# Altium schematic sheet CANduino.SchDoc
size A3; SheetNumber: 1; SheetTotal: 1
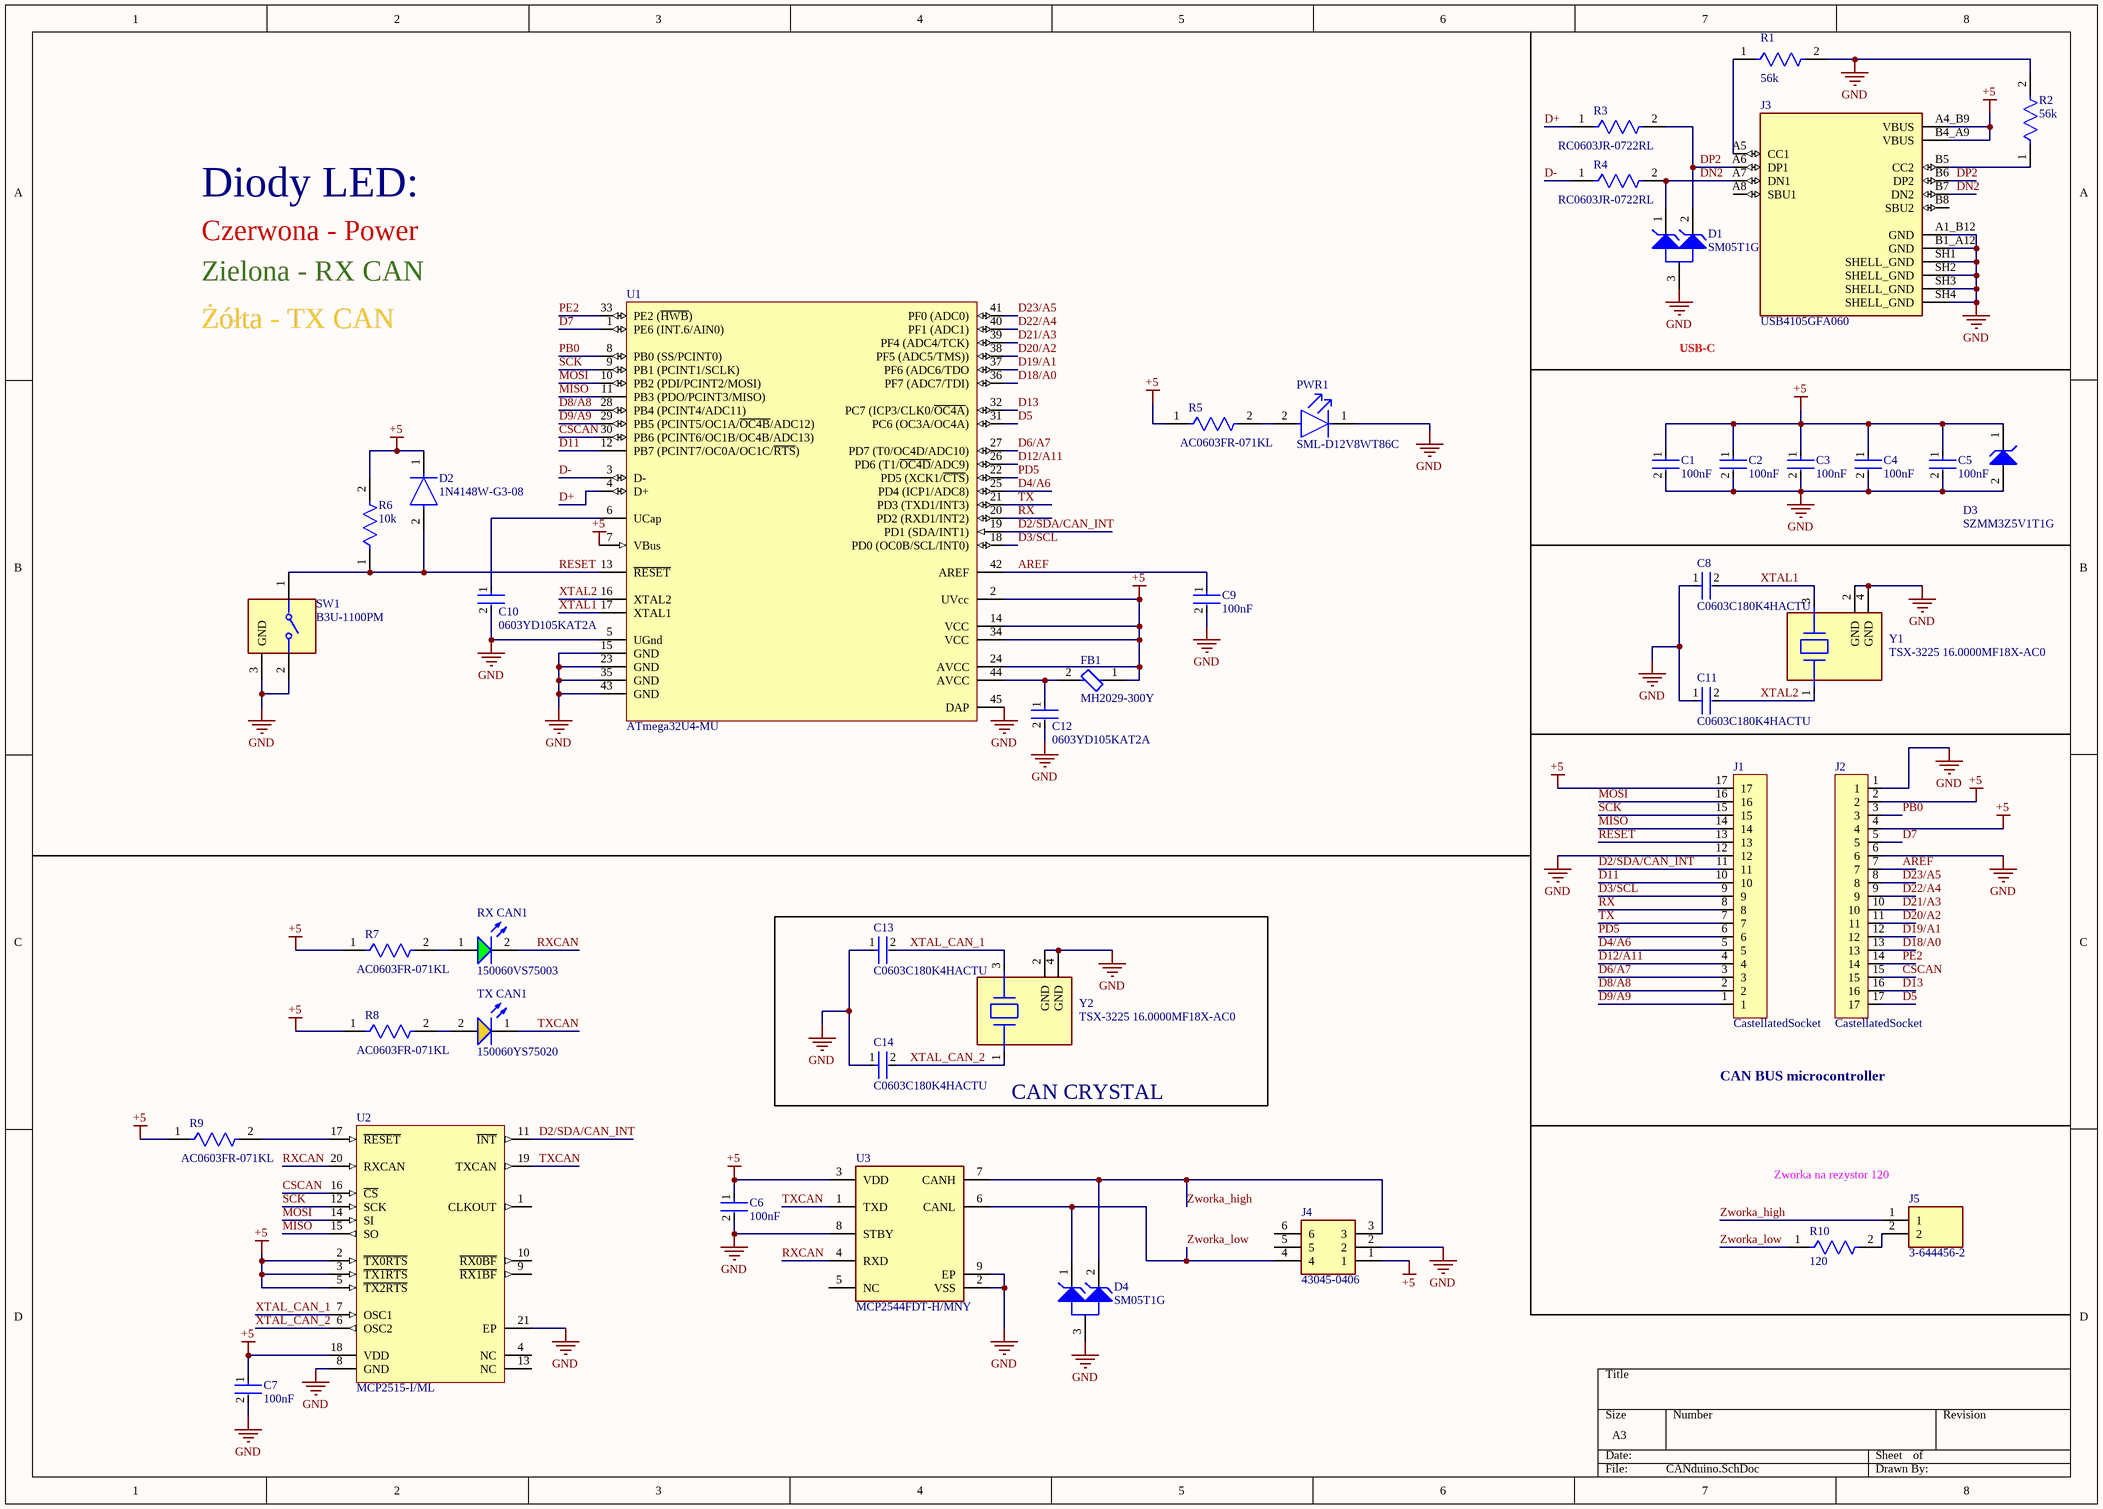
[diagram p0: CANduino.SchDoc]

## Parts
C1  100nF  [FP-0603-L_1_6_0_1-W_0_8_0-IPC_C]
C2  100nF  [FP-0603-L_1_6_0_1-W_0_8_0-IPC_C]
C3  100nF  [FP-0603-L_1_6_0_1-W_0_8_0-IPC_C]
C4  100nF  [FP-0603-L_1_6_0_1-W_0_8_0-IPC_C]
C5  100nF  [FP-0603-L_1_6_0_1-W_0_8_0-IPC_C]
C6  100nF  [FP-0603-L_1_6_0_1-W_0_8_0-IPC_C]
C7  100nF  [FP-0603-L_1_6_0_1-W_0_8_0-IPC_C]
C8  C0603C180K4HACTU  [FP-C0603C-CF-MFG]
C9  100nF  [FP-0603-L_1_6_0_1-W_0_8_0-IPC_C]
C10  0603YD105KAT2A  [FP-0603-L_1_6_0_15-W_0_81-IPC_B]
C11  C0603C180K4HACTU  [FP-C0603C-CF-MFG]
C12  0603YD105KAT2A  [FP-0603-L_1_6_0_15-W_0_81-IPC_B]
C13  C0603C180K4HACTU  [FP-C0603C-CF-MFG]
C14  C0603C180K4HACTU  [FP-C0603C-CF-MFG]
D1  SM05T1G  [ONSC-SOT-23-3-318-08_V]
D2  1N4148W-G3-08  [FP-S8-V-3910_01-001-MFG]
D3  SZMM3Z5V1T1G  [ONSC-SOD-323-2-477-02_V]
D4  SM05T1G  [ONSC-SOT-23-3-318-08_V]
FB1  MH2029-300Y  [FP-MH2029-MFG]
J1  CastellatedSocket  [Castellatedsocket]
J2  CastellatedSocket  [Castellatedsocket]
J3  USB4105GFA060  [GCT_USB4105GFA060]
J4  43045-0406  [43045-04YY_060708_1]
J5  3-644456-2  [TE_3-644456-2]
PWR1  SML-D12V8WT86C  [FP-SML-D12-MFG]
R1  56k  [FP-RR0816-IPC_C]
R2  56k  [FP-RR0816-IPC_C]
R3  RC0603JR-0722RL  [FP-RC0603-0_55-IPC_C]
R4  RC0603JR-0722RL  [FP-RC0603-0_55-IPC_C]
R5  AC0603FR-071KL  [FP-AC0603-IPC_B]
R6  10k  [FP-MCT0603-IPC_C]
R7  AC0603FR-071KL  [FP-AC0603-IPC_B]
R8  AC0603FR-071KL  [FP-AC0603-IPC_B]
R9  AC0603FR-071KL  [FP-AC0603-IPC_B]
R10  120  [FP-CRCW0603-e3-MFG]
RX_CAN1  150060VS75003  [WL-SMCW_0603_150060xx75003]
SW1  B3U-1100PM  [FP-B3U-1100PM-MFG]
TX_CAN1  150060YS75020  [WL-SMCW_0603_150060xx75020]
U1  ATmega32U4-MU  [44PW_M]
U2  MCP2515-I/ML  [QFN-ML20_L]
U3  MCP2544FDT-H/MNY  [FP-C04-129-MNY-MFG]
Y1  TSX-3225 16.0000MF18X-AC0  [FP-TSX-3225-MFG]
Y2  TSX-3225 16.0000MF18X-AC0  [FP-TSX-3225-MFG]

## Blocks framed on the sheet
CAN CRYSTAL: C13 C14 Y2

## Nets
+5: C1.1 C2.1 C3.1 C4.1 C5.1 C6.1 C7.1 D2.1(C) D3.1(K) FB1.1 J1.17 J2.2 J2.4 J3.A4_B9(VBUS) J3.B4_A9(VBUS) J4.1 R5.1 R6.2 R7.1 R8.1 R9.1 U1.2(UVcc) U1.7(VBus) U1.14(VCC) U1.24(AVCC) U1.34(VCC) U2.2(~{TX0RTS}) U2.3(~{TX1RTS}) U2.5(~{TX2RTS}) U2.18(VDD) U3.3(VDD)
GND: C1.2 C2.2 C3.2 C4.2 C5.2 C6.2 C7.2 C8.1 C9.2 C10.2 C11.1 C12.2 C13.1 C14.1 D1.3(A) D3.2(A) D4.3(A) J1.12 J2.1 J2.6 J3.A1_B12(GND) J3.B1_A12(GND) J3.SH1(SHELL_GND) J3.SH2(SHELL_GND) J3.SH3(SHELL_GND) J3.SH4(SHELL_GND) J4.2 PWR1.1(C) R1.2 R2.2 SW1.2 SW1.3(GND) U1.5(UGnd) U1.15(GND) U1.23(GND) U1.35(GND) U1.43(GND) U1.45(DAP) U2.8(GND) U2.21(EP) U3.2(VSS) U3.8(STBY) U3.9(EP) Y1.2(GND) Y1.4(GND) Y2.2(GND) Y2.4(GND)
AREF: C9.1 J2.7 U1.42(AREF)
CSCAN: J2.15 U1.30(PB6_(PCINT6/OC1B/OC4B/ADC13)) U2.16(~{CS})
D2/SDA/CAN_INT: J1.11 U1.19(PD1_(SDA/INT1)) U2.11(~{INT})
D3/SCL: J1.9 U1.18(PD0_(OC0B/SCL/INT0))
D4/A6: J1.5 U1.25(PD4_(ICP1/ADC8))
D5: J2.17 U1.31(PC6_(OC3A/OC4A))
D6/A7: J1.3 U1.27(PD7_(T0/OC4D/ADC10))
D7: J2.5 U1.1(PE6_(INT.6/AIN0))
D8/A8: J1.2 U1.28(PB4_(PCINT4/ADC11))
D9/A9: J1.1 U1.29(PB5_(PCINT5/OC1A/~{OC4B}/ADC12))
D11: J1.10 U1.12(PB7_(PCINT7/OC0A/OC1C/~{RTS}))
D12/A11: J1.4 U1.26(PD6_(T1/~{OC4D}/ADC9))
D13: J2.16 U1.32(PC7_(ICP3/CLK0/~{OC4A}))
D18/A0: J2.13 U1.36(PF7_(ADC7/TDI))
D19/A1: J2.12 U1.37(PF6_(ADC6/TDO)
D20/A2: J2.11 U1.38(PF5_(ADC5/TMS)))
D21/A3: J2.10 U1.39(PF4_(ADC4/TCK))
D22/A4: J2.9 U1.40(PF1_(ADC1))
D23/A5: J2.8 U1.41(PF0_(ADC0))
D+: R3.1 U1.4(D+)
D-: R4.1 U1.3(D-)
DN2: D1.1(K1) J3.A7(DN1) J3.B7(DN2) R4.2
DP2: D1.2(K2) J3.A6(DP1) J3.B6(DP2) R3.2
MISO: J1.14 U1.11(PB3_(PDO/PCINT3/MISO)) U2.15(SO)
MOSI: J1.16 U1.10(PB2_(PDI/PCINT2/MOSI)) U2.14(SI)
PB0: J2.3 U1.8(PB0_(SS/PCINT0))
PD5: J1.6 U1.22(PD5_(XCK1/~{CTS}))
PE2: J2.14 U1.33(PE2_(~{HWB}))
RESET: D2.2(A) J1.13 R6.1 SW1.1 U1.13(~{RESET})
RX: J1.8 U1.20(PD2_(RXD1/INT2))
RXCAN: RX_CAN1.2(K) U2.20(RXCAN) U3.4(RXD)
SCK: J1.15 U1.9(PB1_(PCINT1/SCLK)) U2.12(SCK)
TX: J1.7 U1.21(PD3_(TXD1/INT3))
TXCAN: TX_CAN1.1(K) U2.19(TXCAN) U3.1(TXD)
XTAL1: C8.2 U1.17(XTAL1) Y1.3
XTAL2: C11.2 U1.16(XTAL2) Y1.1
XTAL_CAN_1: C13.2 U2.7(OSC1) Y2.3
XTAL_CAN_2: C14.2 U2.6(OSC2) Y2.1
Zworka_high: D4.2(K2) J4.3 J5.1 U3.7(CANH)
Zworka_low: D4.1(K1) J4.4 R10.1 U3.6(CANL)
NetC10_1: C10.1 U1.6(UCap)
NetC12_1: C12.1 FB1.2 U1.44(AVCC)
NetJ3_A5: J3.A5(CC1) R1.1
NetJ3_B5: J3.B5(CC2) R2.1
NetJ5_2: J5.2 R10.2
NetPWR1_2: PWR1.2(A) R5.2
NetR7_2: R7.2 RX_CAN1.1(A)
NetR8_2: R8.2 TX_CAN1.2(A)
NetR9_2: R9.2 U2.17(~{RESET})

Not connected (* = marked no-connect by the designer): J3 A8(SBU1) B8(SBU2); J4 5 6; U2 1(CLKOUT) 4(NC) 9(~{RX1BF}) 10(~{RX0BF}) 13(NC); U3 5(NC)

## Notes on the sheet
- Diody LED:
- Czerwona - Power
- Zielona - RX CAN
- Żółta - TX CAN
- USB-C
- CAN BUS microcontroller
- Zworka na rezystor 120

## Library data of the parts
C1-C7 C9 = CMP-14477-000532-2: None; Dielectric: X5R; Voltage Rating: 50V; Tolerance: 10%; Thickness: 0.035inch; Lead Free: Lead Free; Case/Package: 0603; Min Operating Temperature: -55°C; RoHS Compliant: Yes; Mount: Surface Mount; Width: 0.031inch; Max Operating Temperature: 85°C; Height: 0.8mm; Case Code (Imperial): 0603; Capacitance: 100nF; Case Code (Metric): 1608; Package Quantity: 4000; Packaging: Tape and Reel; Voltage Rating (DC): 50V; Halogen Free: Halogen Free; Termination: SMD/SMT; Length: 0.063inch; Ratings: AEC-Q200
C8 C11 C13 C14 = CMP-03020-027993-1: C0603 18 pF X8R 30ppm/°C 10.00% 16 V; Manufacturer: KEMET; Voltage Rating: 16 V; Material: Ceramic; Capacitance: 18 pF; Tolerance: 0.1; Automotive Grade: Grade 1; Value: 18 pF; ComponentLink2URL: https://api.kemet.com/component-edge/download/datasheet/C0603C100J5GACAUTO.pdf; Package: C0603C-CF; Temperature Range Low: -55°C; Temperature Characteristic: X8R; Temperature Coefficient: 30ppm/°C; Lead Free: Yes; ComponentLink2Description: Datasheet; Automotive: Yes; Octopart: https://octopart.com/c0603c180k4hactu-kemet-88725221; Height: 0.87mm; Temperature: -55°C to +125°C; Manufacturer Part Number: C0603C180K4HACTU; Temperature Range High: +125°C; Device Class L1: Passive Components; Device Class L3: Ceramic Capacitors; Category: Cap; RoHS: TRUE; Device Class L2: Capacitors
C10 C12 = CMP-2006-04532-2: General Purpose Ceramic Capacitor, 0603, 1uF, 10%, X5R, 15%, 16V; Dissipation Factor: 12.5%; Insulation Resistance: 10GR; Case/Package: 0603; Depth: 0.81mm; Max Operating Temperature: 85°C; Number of Pins: 2; Thickness: 0.035inch; Packaging: Tape and Reel; RoHS Compliant: Yes; Construction: Flat; Mount: Surface Mount; Width: 0.81mm; Case Code (Metric): 1608; Voltage Rating (DC): 16V; Voltage: 16V; Height: 0.9mm; Capacitance: 1uF; Length: 1.6mm; Dielectric: X5R; Voltage Rating: 16V; Radiation Hardening: No; Series: -; Case Code (Imperial): 0603; Tolerance: 10%; Lead Free: Lead Free; Termination: SMD/SMT; Min Operating Temperature: -55°C; Package Quantity: 1; REACH SVHC: No SVHC
D1 D4 = CMP-1061-00666-1: Transient Voltage Suppressor Diode Array, Dual Common Anode Diodes for ESD Protection, 3-Pin SOT-23, Pb-Free, Tape and Reel; Manufacturer: On Semiconductor; Direction: Unidirectional; IR Max (uA): 10; PPK Max (W): 300; ComponentLink2Description: Datasheet; PackageVersion: Rev. AP, 11/2009; ComponentLink2URL: http://www.onsemi.com/pub_link/Collateral/SM12T1-D.PDF; DatasheetVersion: Rev. 6; Packing: Tape and Reel; PartNumber: SM05T1G; ComponentLink3Description: Package Specification; ComponentLink1URL: http://www.onsemi.com/; ComponentLink3URL: http://www.onsemi.cn/pub_link/Collateral/318-08.PDF; PackageReference: SOT-23-3-318-08; ComponentLink1Description: Manufacturer URL; PackageDescription: 3-Pin Small Outline Transistor, Body 2.92 x 1.3 mm, Pitch 0.95 mm; Mounting Technology: Surface Mount; RoHS: Pb-Free
D2 = CMP-00030-46456310-1: 1N4148W-G3-08 Rectifier Diode, 1 Phase, 1 Element, 0.15A, 100V V(RRM), Silicon; Forward Current: 150mA; Reverse Recovery Time: 4ns; Peak Non-Repetitive Surge Current: 500mA; Element Configuration: Single; Forward Voltage: 1.2V; Max Reverse Voltage (DC): 75V; Schedule B: 8541100070, 8541100070; Max Repetitive Reverse Voltage (Vrrm): 100V; Weight: 9.412042mg; NexarPartId: 46456310; Contact Plating: Tin; Max Operating Temperature: 150°C; Case/Package: SOD; Mount: Surface Mount; RoHS: Compliant; Min Operating Temperature: -55°C; Average Rectified Current: 150mA; Number of Pins: 2
D3 = CMP-1060-00693-1: Zener Voltage Regulator, 300 mW, 2-Pin SOD-323, Pb-Free, Tape and Reel; Manufacturer: On Semiconductor; VZ Typ (V): 5.1; P Max (W): 0.3; Mounting Technology: Surface Mount; PackageVersion: Rev. H, 03/2007; ComponentLink1Description: Manufacturer URL; ComponentLink2Description: Datasheet; ComponentLink3Description: Package Specification; DatasheetVersion: Rev. 9; ComponentLink3URL: http://www.onsemi.com/pub_link/Collateral/477-02.PDF.1; PartNumber: SZMM3Z5V1T1G; RoHS: Pb-Free; PackageReference: SOD-323-2-477-02; PackageDescription: 2-Pin SOD, Body 1.7 x 1.25 mm; Packing: Tape and Reel; ComponentLink2URL: http://www.onsemi.cn/pub_link/Collateral/MM3Z2V4T1-D.PDF; ComponentLink1URL: http://www.onsemi.com/
FB1 = CMP-07252-000001-1: FERRITE BEAD 30 OHM 0805 1LN; Manufacturer: Bourns; Series Resistance: 25mΩ; Resistance: 30Ω; Value: 30Ω; Impedance At Frequency: 30Ω @ 100MHz; Rms Current: 3A; Tolerance: 25%; RoHS: TRUE; Manufacturer Part Number: MH2029-300Y; Temperature Range High: +125°C; Device Class L3: Ferrite Beads and Chips; Core Material: Ferrite; ComponentLink2Description: Datasheet; Category: FBead; Octopart: https://octopart.com/mh2029-300y-bourns-756929; Digikey Description: FERRITE BEAD 30 OHM 0805 1LN; Device Class L2: EMI / RFI Components; Lead Free: Yes; Mouser Description: Ferrite Beads 30 ohms 25% HIGH CURRENT; Automotive: No; Ipc Land Pattern Name: CAPC200120X90; Temperature: -55°C to +125°C; Device Class L1: Passive Components; Height: 1.1mm; ComponentLink2URL: https://www.bourns.com/docs/Product-Datasheets/mh.pdf; Package: MH2029; Temperature Range Low: -55°C
J3 = CMP-003-000000-1: MF: {'manufacturer': u'GCT'}; Package: None; Source: USB4105GFA060.SchLib; Pin Count: 16; Component Type: Standard; Value: *; Design Item ID: USB4105GFA060; Availability: Unavailable; Price: None; MP: USB4105GFA060
J4 = 43045-0406: Connector; Manufacturer_Name: Molex; Datasheet Link: https://www.molex.com/pdm_docs/sd/430450206_sd.pdf; Height: 8.77mm; Manufacturer_Part_Number: 43045-0406; Mouser Part Number: 538-43045-0406; Mouser Price/Stock: https://www.mouser.co.uk/ProductDetail/Molex/43045-0406?qs=UeCeOHRHQeYGnc4y0X6gLg%3D%3D
J5 = CMP-002-00074-1: Connector Unshrouded Header HDR 2 Position 2.54mm Solder Straight Thru-Hole; Centerline_Pitch: 2.54 mm[.1 in]; MF: TE Connectivity; Number_of_Positions: 2; EU_RoHS_Compliance: Compliant; TE_purchase_URL: https://www.te.com/usa-en/product-3-644456-2.html?te_bu=Cor&te_type=disp&te_campaign=seda_glo_cor-seda-global-disp-prtnr-fy19-seda-model-bom-cta_sma-317_1&elqCampaignId=32493; Design Item ID: 3-644456-2; Pins: 2; Component Type: Standard; Source: SnapEDAsch.SchLib; MP: 3-644456-2; Value: *; Digi-Key_Purchase_URL: https://www.digikey.com/product-detail/en/te-connectivity-amp-connectors/3-644456-2/A31112-ND/698344?utm_source=snapeda&utm_medium=aggregator&utm_campaign=symbol; Digi-Key_Part_Number: A31112-ND; Product_Type: Connector; SnapEDA_Link: https://www.snapeda.com/parts/3-644456-2/TE%20Connectivity%20AMP%20Connectors/view-part/520887/?ref=snap; Case/Package: None
PWR1 = CMP-08952-000027-1: LED RED 1608 SMD; Forward Voltage: 2.2V; Luminous Intensity: 40mcd; Lens Size: 0.8mm; Lens Style: Flat; Lens Color: White; Test Current: 20mA; Dominant Wavelength: 630nm; Height: 0.65mm; Length: 1.6mm; Case Code (Metric): 1608; Color: Red; Mount: Surface Mount; Width: 0.8mm; Case Code (Imperial): 0603; Case/Package: 0603; Packaging: Tape and Reel
R1 R2 = CMP-2000-02705-2: 56kΩ ±0.5% 0.0625W 1/16W Chip Resistor 0603 (1608 Metric) Thin Film; Voltage Rating (DC): 75V; Power Rating: 62.5mW; Max Power Dissipation: 63mW; Resistance: 56kR; Temperature Coefficient: 25ppm/°C; Max Operating Temperature: 125°C; Min Operating Temperature: -55°C; Height: 0.4mm; Lead Free: Lead Free; Number of Pins: 2; Tolerance: 0.5%; Packaging: Tape and Reel; Resistance Tolerance: 0.5%; Series: RR; Number of Terminations: 2; Voltage Rating: 75V; Resistor Type: Thin Film; Technology: THIN FILM; Width: 0.031inch; RoHS Compliant: Yes; Termination: SMD/SMT; Length: 1.6mm; Package Quantity: 1; Case Code (Metric): 1608; Case/Package: 0603; Depth: 0.8mm; Case Code (Imperial): 0603
R3 R4 = CMP-03412-037819-1: RES SMD 22 OHM 5% 1/10W 0603; Temperature Coefficient: 100ppm/°C; Max Power Dissipation: 100mW; Voltage Rating: 50V; Resistance: 22R; Length: 1.6mm; Tolerance: 5%; Resistance Tolerance: 5%; Number of Terminations: 2; Construction: Rectangular; Min Operating Temperature: -55°C; Lead Free: Lead Free; Width: 0.8mm; Case Code (Imperial): 0603; Voltage Rating (DC): 50V; Case/Package: 0603; Features: Moisture Resistant; REACH SVHC: No SVHC; Military Standard: Not; RoHS Compliant: Yes; Max Operating Temperature: 155°C; Number of Pins: 2; Termination: SMD/SMT; Case Code (Metric): 1608; Packaging: Tape and Reel; Resistor Type: Thick Film; Depth: 0.8mm; Size Code: 0603; Power Rating: 100mW; Series: RC
R5 R7-R9 = CMP-2000-04828-3: RES 1kΩ 1.00% 0.1W 0603; Voltage Rating: 50V; Power Rating: 100mW; Tolerance: 1%; Temperature Coefficient: 100ppm/°C; Resistance: 1kR; Depth: 0.8mm; Case/Package: 0603; Size Code: 0603; Case Code (Metric): 1608; Height: 0.022inch; Series: AC; Width: 0.031inch; Construction: Rectangular; Length: 0.063inch; Case Code (Imperial): 0603; Package Quantity: 1; RoHS Compliant: Yes; Features: Moisture Resistant; Resistor Type: Thick Film; Max Power Dissipation: 100mW; Packaging: Tape and Reel; Termination: SMD/SMT; Ratings: AEC-Q200; Max Operating Temperature: 155°C; Min Operating Temperature: -55°C; Military Standard: Not; Lead Free: Lead Free; Number of Terminations: 2
R6 = CMP-02407-000418-1: RES SMD 100 OHM 1% 1/8W 0603; Voltage Rating: 75V; Power Rating: 100mW; Temperature Coefficient: 50ppm/°C; Max Power Dissipation: 125mW; Resistance: 10kR; Case/Package: 0603; Military Standard: Not; Min Operating Temperature: -55°C; Width: 0.8mm; Package Quantity: 1; Max Operating Temperature: 125°C; Tolerance: 1%; Depth: 0.85mm; Radiation Hardening: No; Mount: Surface Mount; Composition: Thin Film; Contact Plating: Tin; Lead Free: Lead Free; Case Code (Imperial): 0603; Number of Terminations: 2; Voltage Rating (DC): 75V; Length: 1.55mm; Packaging: Tape and Reel; Height: 0.022inch; Case Code (Metric): 1608
R10 = CMP-1666-00020-3: RES Thick Film, 120Ω, 1%, 0.1W, 100ppm/°C, 0603; Power Rating: 100mW; Working Voltage: 75V; Resistance: 120R; RoHS Compliant: Yes; Lead Free: Lead Free; Termination: SMD/SMT; Radiation Hardening: No; Case Code (Imperial): 0603; Series: CRCW; Resistance Tolerance: 1%; Number of Terminations: 2; Tolerance: 1%; Max Operating Temperature: 155°C; Contact Plating: Tin; Package Quantity: 10; Max Power Dissipation: 100mW; Case Code (Metric): 1608; Weight: 7.1E-05oz; Packaging: Tape and Reel; Mount: Surface Mount; Military Standard: Not; Construction: Rectangular; Features: Automotive AEC-Q200; Depth: 0.85mm; Min Operating Temperature: -55°C; Case/Package: 0603; Height: 0.45mm; Voltage Rating (DC): 75V; Width: 0.033inch; Technology: THICK FILM; Length: 1.55mm; Voltage Rating: 75V; Temperature Coefficient: 100ppm/°C; Resistor Type: Thick Film
RX_CAN1 = CMP-03913-126098672-2: Led, Bright Green, 100Mcd, 572Nm Rohs Compliant: Yes; Forward Voltage: 2V; Viewing Angle: 140°; Forward Current: 100mA; Dominant Wavelength: 567nm; Max Reverse Voltage (DC): 5V; Length: 1.6mm; Max Operating Temperature: 100°C; Width: 800µm; Peak Wavelength: 572nm; RoHS: Compliant; Height: 700µm; Luminous Intensity: 100mcd; Min Operating Temperature: -40°C
SW1 = CMP-08834-000028-1: SWITCH TACTILE SPST-NO 0.05A 12V; Switch Travel: 0.15mm; Throw Configuration: SPST; Current Rating: 50mA; Illumination Type: Non-Illuminated; Actuator Length: 0.4mm; Operating Force: 1.5N; Connector Type: SMD/SMT; Contact Resistance: 100mR; Actuator Type: Standard; Electrical Life: 200000Cycles; Switch Function: Off-Mom; Ratings: Dust Proof; Max Operating Temperature: 70°C; Weight: 0.022g; Series: B3U; Min Operating Temperature: -25°C; Voltage Rating (DC): 12V; Orientation: Straight; Package Quantity: 1000; Packaging: Tape and Reel; RoHS Compliant: Yes; REACH SVHC: No SVHC; Max Voltage Rating (DC): 12V; Mount: Surface Mount; Case/Package: SMD/SMT; Mechanical Life: 200000Cycles; Termination: SMD/SMT
TX_CAN1 = CMP-03913-104891429-2: WL-SMCW SMT Mono-Color Chip LED Waterclear super f; Forward Voltage: 2V; Forward Current: 60mA; Max Reverse Voltage (DC): 5V; Peak Wavelength: 595nm; Viewing Angle: 140°; Dominant Wavelength: 590nm; Luminous Intensity: 130mcd; Width: 800µm; RoHS: Compliant; Min Operating Temperature: -40°C; Max Operating Temperature: 85°C; Length: 1.6mm; Height: 250µm
U1 = CMP-0095-00166-2: 8-bit AVR Microcontroller, 2.7-5.5V, 16MHz, 32KB Flash, 1KB EEPROM, 2.5KB SRAM, USB Controller, 44-pin QFN, Industrial Grade (-40°C to 85°C), Ext Osc; PackageVersion: revG, Sep-2009; PackageReference: 44PW; ComponentLink1URL: http://www.atmel.com/; PackageDescription: 44-Pin Quad Flat No-Lead Package, 7 x 7 mm Body, 0.5 mm Pitch (QFN); ComponentLink3Description: ATmega16U4 ATmega32U4 Summary; RevisionNote: DatasheetVersion, PackageVersion & PCB updated. URLs added.; ComponentLink2Description: ATmega16U4/32U4 Datasheet; ComponentLink1Description: Manufacturer URL; ComponentLink3URL: http://www.atmel.com/dyn/resources/prod_documents/7766S.pdf; DatasheetVersion: revF, Nov-2010; ComponentLink2URL: http://www.atmel.com/dyn/resources/prod_documents/doc7766.pdf; Code_JEDEC: MO-220-VKKD-1
U2 = CMP-0186-00187-1: Stand-Alone CAN Controller With SPI Interface, 20-Pin QFN, Industrial Temperature; DatasheetVersion: revF, Oct-2010; ComponentLink1URL: http://www.microchip.com/; ComponentLink3URL: http://www.microchip.com/stellent/groups/techpub_sg/documents/packagingspec/en012702.pdf; ComponentLink2Description: Datasheet; PackageDescription: 20-Lead Plastic Quad Flat, No Lead Package (ML) - 4x4x0.9 mm Body [QFN]; PackageVersion: revBB, Aug-2009; ComponentLink3Description: Package Specification; ComponentLink2URL: http://ww1.microchip.com/downloads/en/DeviceDoc/21801F.pdf; PackageReference: QFN-ML20; ComponentLink1Description: Manufacturer URL
U3 = CMP-06279-000073-1: IC TRANSCEIVER 1/1 8TDFN; Receiver Hysteresis: 200mV; Data Rate: 8Mbps; Series: -; Packaging: Cut Tape; Mount: Surface Mount; Max Operating Temperature: 150°C; RoHS Compliant: Yes; Min Operating Temperature: -40°C
Y1 Y2 = CMP-36405-000005-1: CRYSTAL 16.00 MHZ 9PF SMD; Manufacturer: EPSON; Stability: 18ppm; Esr: 60Ω; Frequency: 16MHz; Tolerance: 10ppm; Series: TSX-3225; Manufacturer Part Number: TSX-3225 16.0000MF18X-AC0; Temperature Range High: +85°C; ComponentLink2URL: https://support.epson.biz/td/api/doc_check.php?dl=brief_TSX-3225&lang=en; Temperature Range Low: -40°C; RoHS: TRUE; Lead Free: Yes; Mouser Description: CRYSTAL 16.00 MHZ 9PF SMD; Category: Crys; Temperature: -40°C to +85°C; Device Class L1: Passive Components; Height: 0.6mm; Octopart: https://octopart.com/tsx-3225+16.0000mf18x-ac0-epson-58756552; Automotive: No; Digikey Description: CRYSTAL 16.00 MHZ 9PF SMD; ComponentLink2Description: Datasheet; Load Capacitance: 9pF; Package: TSX-3225; Device Class L3: Crystals; Device Class L2: Crystals / Oscillators